# Altium schematic sheet oxi_dev2(modified).SchDoc
size A1
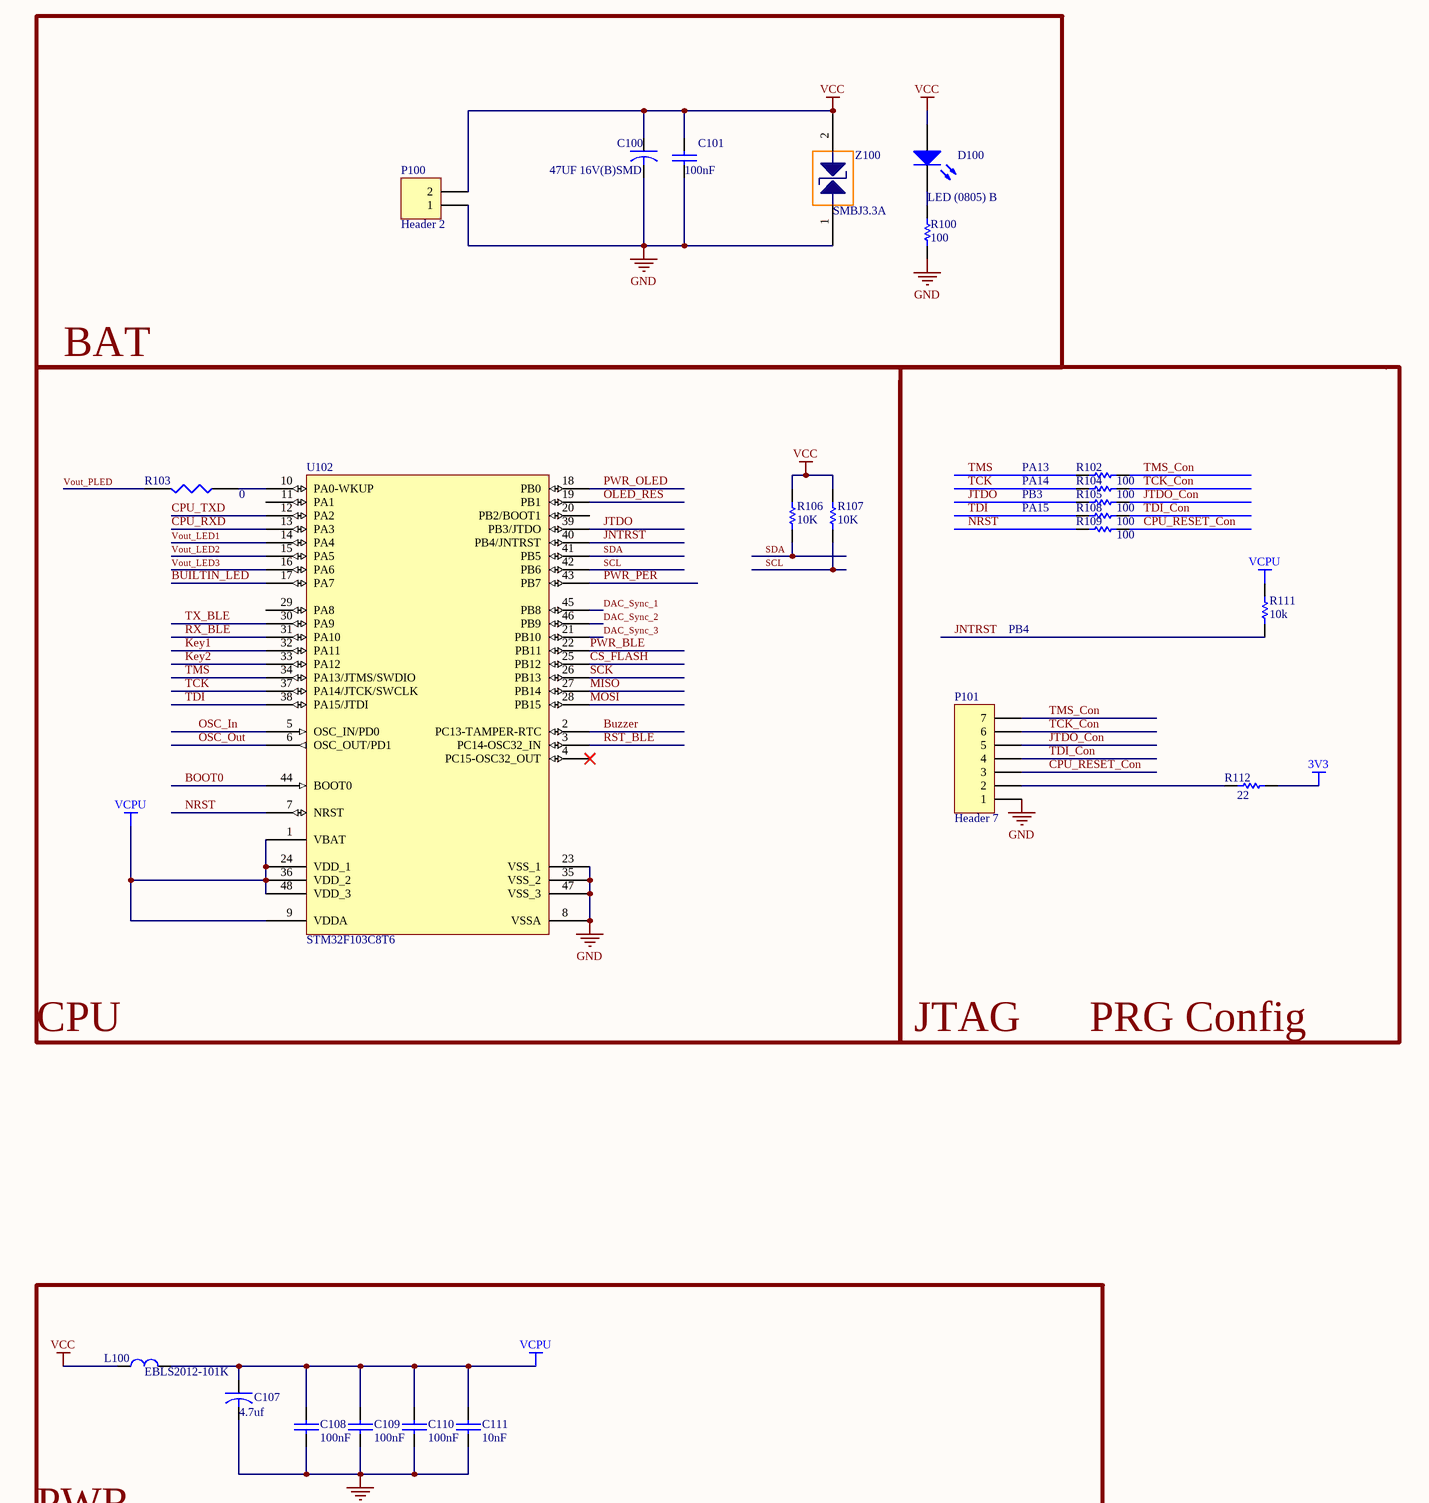
[diagram p0: oxi_dev2(modified).SchDoc, top left]
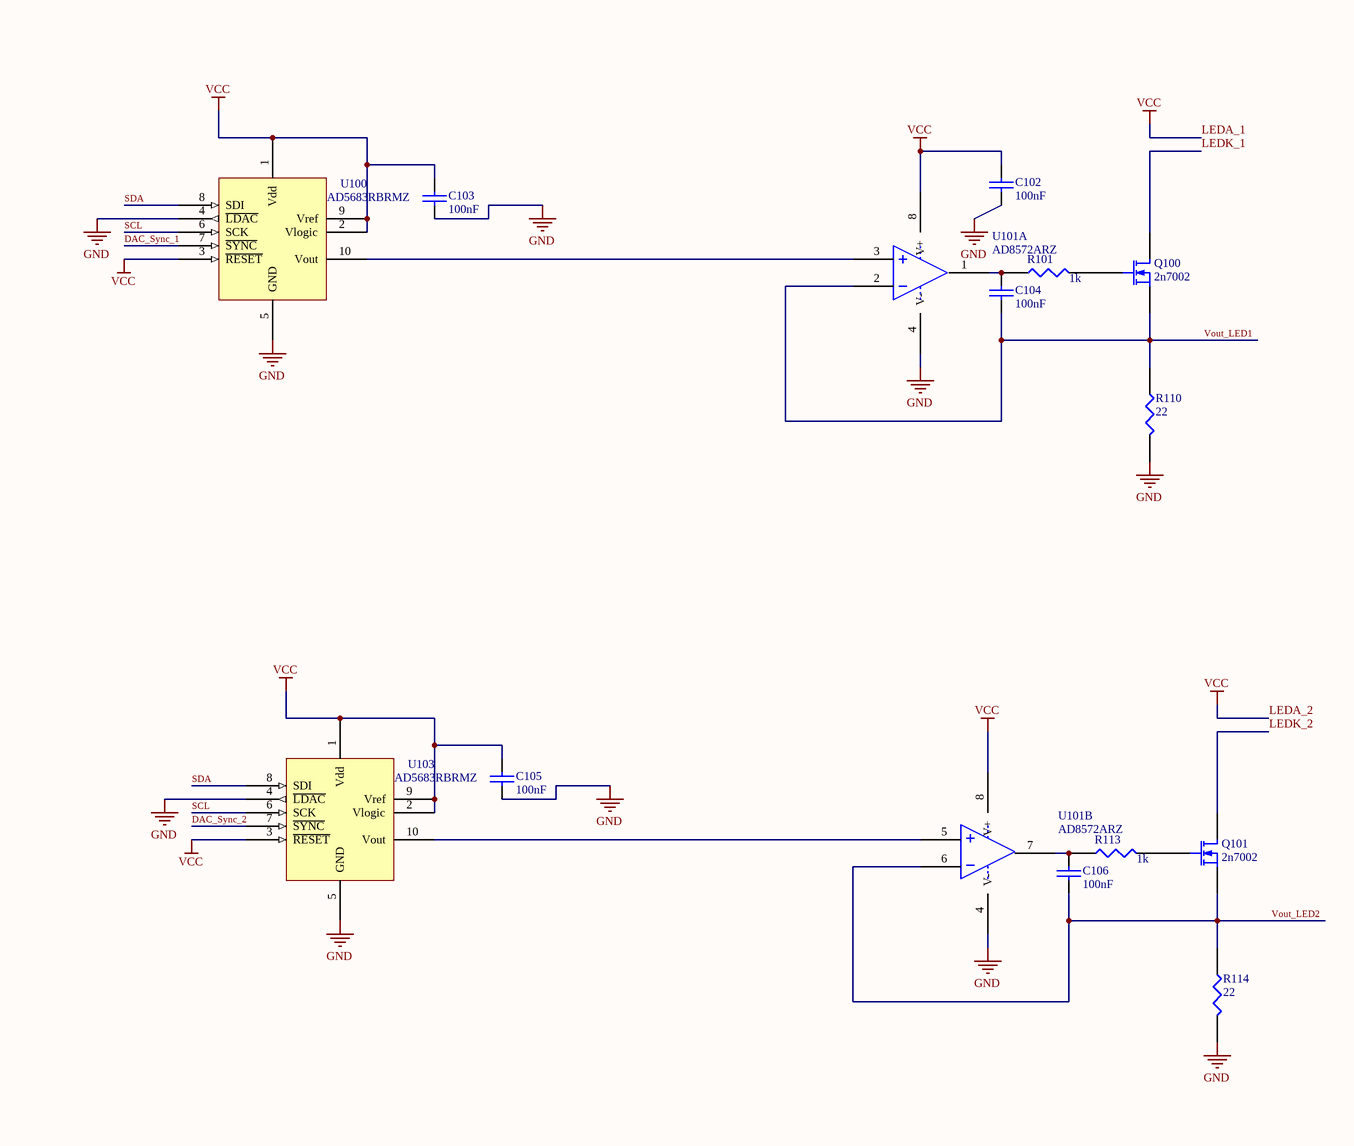
[diagram p1: oxi_dev2(modified).SchDoc, top middle]
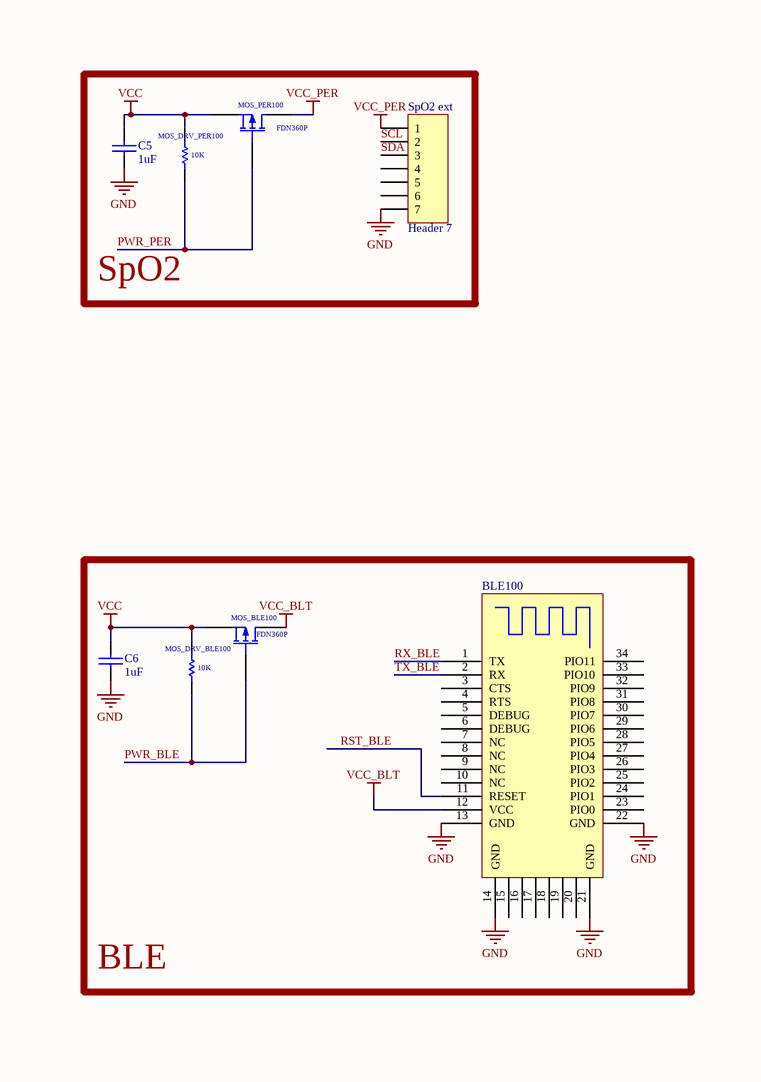
[diagram p2: oxi_dev2(modified).SchDoc, top right]
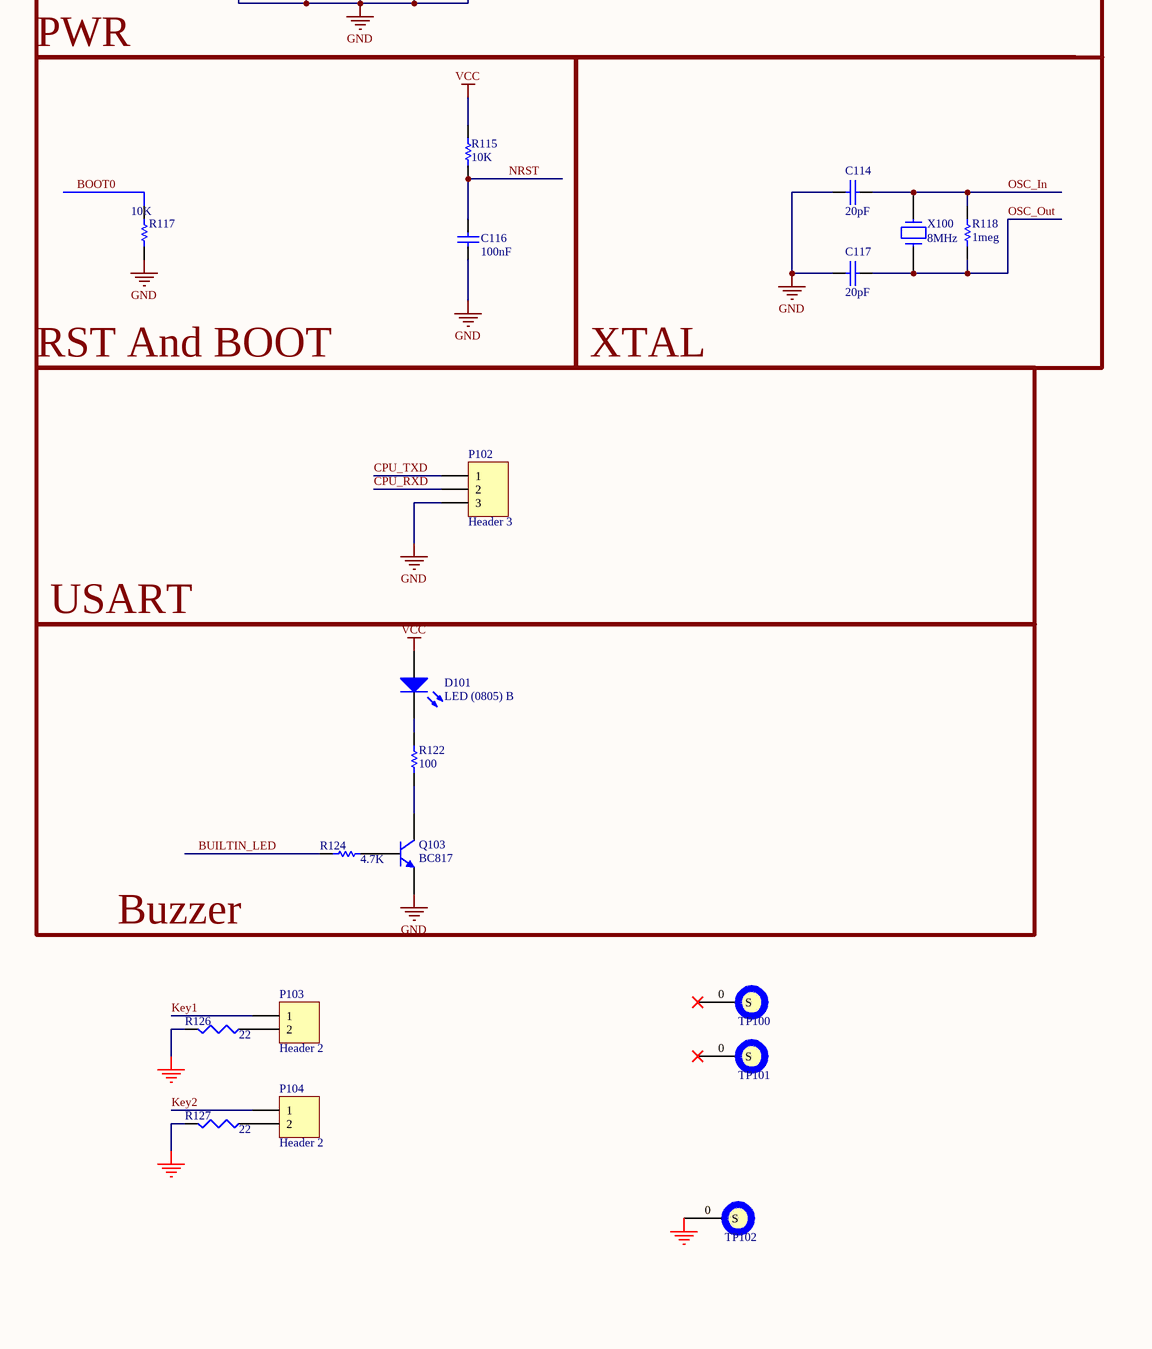
[diagram p3: oxi_dev2(modified).SchDoc, bottom left]
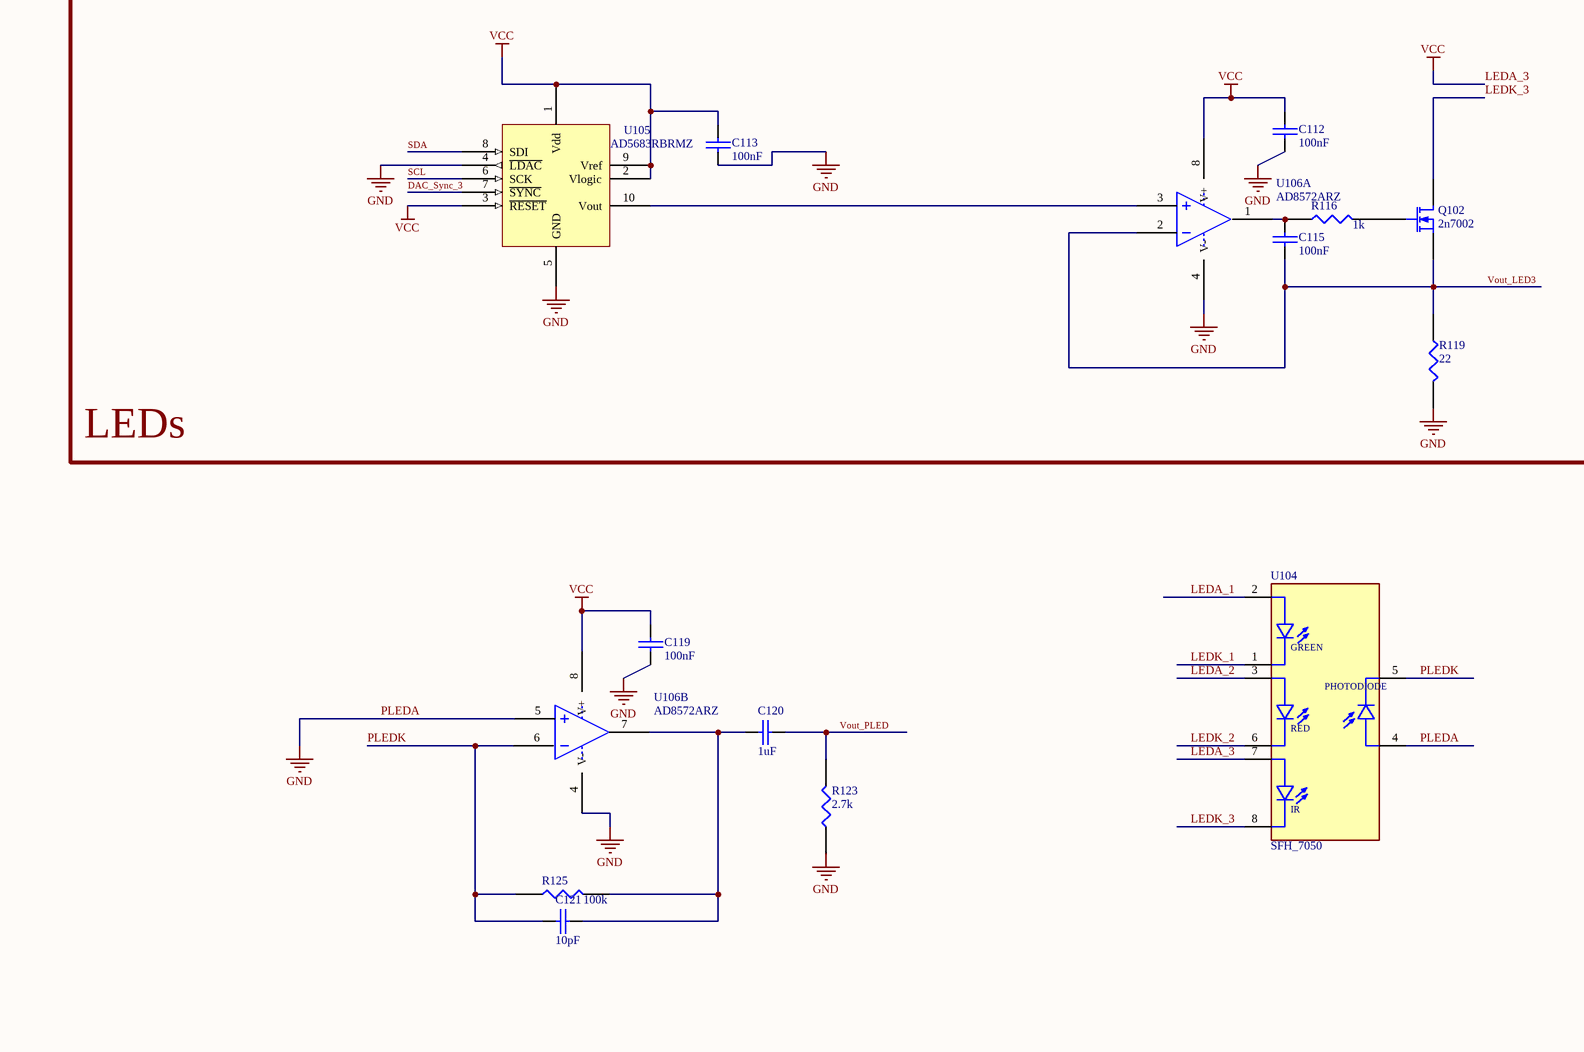
[diagram p4: oxi_dev2(modified).SchDoc, bottom middle]
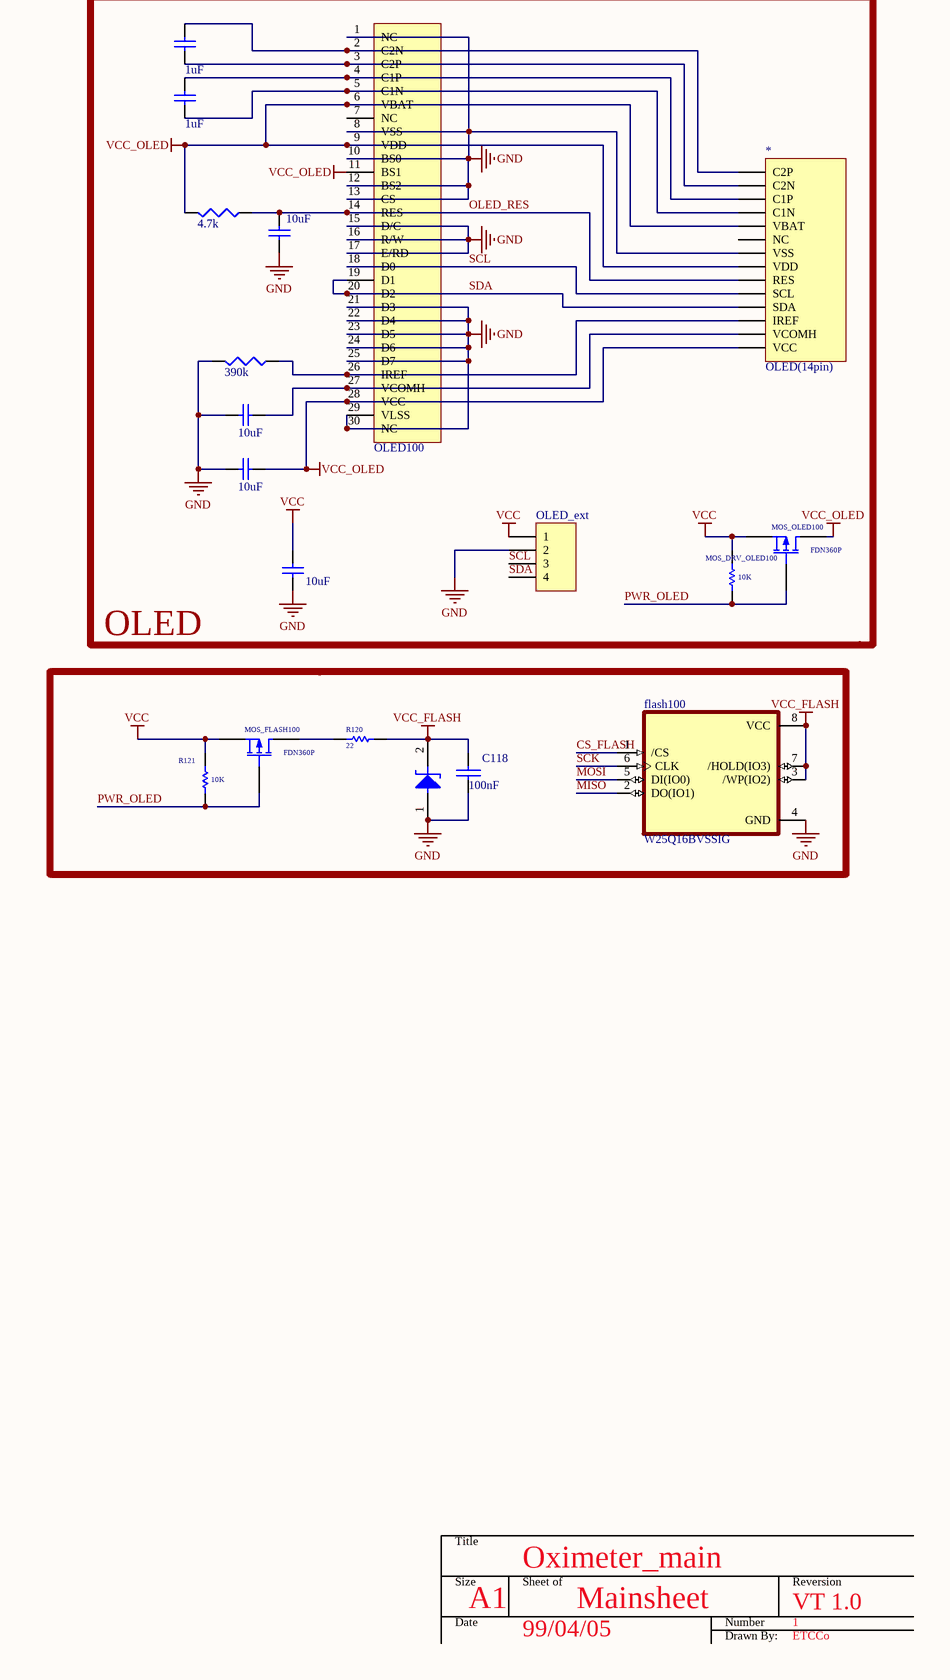
[diagram p5: oxi_dev2(modified).SchDoc, bottom right]

## Parts
*  OLED(14pin)  [oled0.91_no3d]
BLE100  HM-16  [HM-16]  (value not drawn)
BRIGHTNESS_RES100  value 390k  [SMD-0805C]  (hidden comment: Res3)
C5  1uF  [0603-2]
C6  1uF  [0603-2]
C100  47UF 16V(B)SMD  [a_SMB]
C101  100nF  [0805-CAP]
C102  100nF  [0805-2]
C103  100nF  [0805-2]
C104  100nF  [0805-2]
C105  100nF  [0805-2]
C106  100nF  [0805-2]
C107  4.7uf  [CAP-A]
C108  100nF  [0603-2]
C109  100nF  [0603-2]
C110  100nF  [0603-2]
C111  10nF  [0603-2]
C112  100nF  [0805-2]
C113  100nF  [0805-2]
C114  20pF  [0805-2]
C115  100nF  [0805-2]
C116  100nF  [0805-2]
C117  20pF  [0805-2]
C118  100nF  [0805-CAP]
C119  100nF  [0805-2]
C120  1uF  [0805-2]
C121  10pF  [0805-2]
C_PUMP_100  value 1uF  [SMD-0805C]  (hidden comment: Cap Semi)
C_PUMP_101  value 1uF  [SMD-0805C]  (hidden comment: Cap Semi)
C_PUMP_VCMON100  value 10uF  [SMD-0805C]  (hidden comment: Cap Semi)
D100  LED (0805) B  [0805D]
D101  LED (0805) B  [0805D]
flash100  W25Q16BVSSIG  [SOIC127P790X216-8N]
L100  EBLS2012-101K  [0805-2]
MOS_BLE100  FDN360P  [SOT23_N]
MOS_DRV_BLE100  10K  [SMD-0805C]
MOS_DRV_OLED100  10K  [SMD-0805C]
MOS_DRV_PER100  10K  [SMD-0805C]
MOS_FLASH100  FDN360P  [SOT23_N]
MOS_OLED100  FDN360P  [SOT23_N]
MOS_PER100  FDN360P  [SOT23_N]
OLED100  OLED  [OLED0.96_NO3D]  (value not drawn)
OLED_C_STABILITY100  value 10uF  [SMD-0805C]  (hidden comment: Cap Semi)
OLED_C_STABILITY?  value 10uF  [SMD-0805C]  (hidden comment: Cap Semi)
OLED_ext  Header 4  [HDR1X4]  (value not drawn)
OLED_RES_PU100  value 4.7k  [SMD-0805C]  (hidden comment: Res3)
P100  Header 2  [A_HDR1X2]
P101  Header 7  [HDR1X7_Editted]
P102  Header 3  [A_HDR1X3_editted]
P103  Header 2  [TACT-1]
P104  Header 2  [TACT-1]
Q100  2n7002  [a_SOT23]
Q101  2n7002  [a_SOT23]
Q102  2n7002  [a_SOT23]
Q103  BC817  [SOT23]
R100  100  [0805-2]
R101  1k  [0603-2]
R102  100  [0805-2]
R103  0  [0603-2]
R104  100  [0805-2]
R105  100  [0805-2]
R106  10K  [0805-2]
R107  10K  [0805-2]
R108  100  [0805-2]
R109  100  [0805-2]
R110  22  [0603-2]
R111  10k  [0603-2]
R112  22  [0805-2]
R113  1k  [0603-2]
R114  22  [0603-2]
R115  10K  [0805-2]
R116  1k  [0603-2]
R117  10K  [0603-2]
R118  1meg  [0805-2]
R119  22  [0603-2]
R120  22  [SMD-0805C]
R121  10K  [SMD-0805C]
R122  100  [0805-2]
R123  2.7k  [0603-2]
R124  4.7K  [0603-2]
R125  100k  [0603-2]
R126  22  [0805-2]
R127  22  [0805-2]
RES_BYPASS100  value 10uF  [SMD-0805C]  (hidden comment: Cap Semi)
SpO2_ext  Header 7  [HDR1X7_Editted]
TP100  HOLE  [A_Ert]  (value not drawn)
TP101  HOLE  [A_Ert]  (value not drawn)
TP102  HOLE  [TP_Net]  (value not drawn)
U100  AD5683RBRMZ  [SO-10]
U101  AD8572ARZ  [SO-8]  (parts A,B of 2)
U102  STM32F103C8T6  [LQFP48_N]
U103  AD5683RBRMZ  [SO-10]
U104  SFH_7050  [XDCR_SFH_7050]
U105  AD5683RBRMZ  [SO-10]
U106  AD8572ARZ  [SO-8]  (parts A,B of 2)
X100  8MHz  [A_XTAL]
Z100  SMBJ3.3A  [a_SMB]
ZEN_USB100  5V  [DSMD]  (value not drawn)

## Blocks framed on the sheet
BAT: C100 C101 D100 P100 R100 Z100
LEDs: C102-C106 C112 C113 C115 Q100-Q102 R101 R110 R113 R114 R116 R119 U100 U101 U103 U105 U106
BLE: BLE100 C6 MOS_BLE100 MOS_DRV_BLE100
PWR: C107-C111 L100
OLED: * BRIGHTNESS_RES100 C_PUMP_100 C_PUMP_101 C_PUMP_VCMON100 MOS_DRV_OLED100 MOS_OLED100 OLED100 OLED_C_STABILITY100 OLED_C_STABILITY? OLED_ext OLED_RES_PU100 RES_BYPASS100

## Nets
3V3: R112.2
LEDA_1: C5.1 C6.1 C100.2 C101.1 C102.1 C103.1 C105.1 C112.1 C113.1 C119.1 D100.1(A) D101.1(A) L100.1 MOS_BLE100.2(S) MOS_DRV_BLE100.1 MOS_DRV_OLED100.1 MOS_DRV_PER100.1 MOS_FLASH100.2(S) MOS_OLED100.2(S) MOS_PER100.2(S) OLED_C_STABILITY?.1 OLED_ext.1 P100.2 R106.1 R107.1 R115.2 R121.1 U100.1(Vdd) U100.2(Vlogic) U100.3(~{RESET}) U100.9(Vref) U101.8(V+) U103.1(Vdd) U103.2(Vlogic) U103.3(~{RESET}) U103.9(Vref) U104.2(GA) U104.3(RA) U104.7(IA) U105.1(Vdd) U105.2(Vlogic) U105.3(~{RESET}) U105.9(Vref) U106.8(V+) Z100.2  [also labelled LEDA_2, LEDA_3, VCC]
PLEDA: *.7(VSS) BLE100.13(GND) BLE100.14(GND) BLE100.21(GND) BLE100.22(GND) BRIGHTNESS_RES100.2 C5.2 C6.2 C100.1 C101.2 C102.2 C103.2 C105.2 C107.2 C108.2 C109.2 C110.2 C111.2 C112.2 C113.2 C114.2 C116.1 C117.2 C118.2 C119.2 C_PUMP_VCMON100.2 flash100.4(GND) OLED100.1(NC) OLED100.8(VSS) OLED100.10(BS0) OLED100.12(BS2) OLED100.13(CS) OLED100.15(D/C) OLED100.16(R/W) OLED100.17(E/RD) OLED100.21(D3) OLED100.22(D4) OLED100.23(D5) OLED100.24(D6) OLED100.25(D7) OLED100.29(VLSS) OLED100.30(NC) OLED_C_STABILITY100.2 OLED_C_STABILITY?.2 OLED_ext.2 P100.1 P101.1 P102.3 Q103.2(E) R100.1 R110.2 R114.2 R117.2 R119.2 R123.1 R126.2 R127.2 RES_BYPASS100.1 SpO2_ext.7 TP102.0(S) U100.4(~{LDAC}) U100.5(GND) U101.4(V-) U102.8(VSSA) U102.23(VSS_1) U102.35(VSS_2) U102.47(VSS_3) U103.4(~{LDAC}) U103.5(GND) U104.4(PA) U105.4(~{LDAC}) U105.5(GND) U106.4(V-) U106.5(IN+) Z100.1 ZEN_USB100.1  [also labelled GND]
VCC_BLT: BLE100.12(VCC) MOS_BLE100.3(D)
VCC_FLASH: C118.1 flash100.3(/WP(IO2)) flash100.7(/HOLD(IO3)) flash100.8(VCC) R120.2 ZEN_USB100.2
VCC_OLED: *.5(VBAT) *.8(VDD) *.14(VCC) MOS_OLED100.3(D) OLED100.6(VBAT) OLED100.9(VDD) OLED100.11(BS1) OLED100.28(VCC) OLED_C_STABILITY100.1 OLED_RES_PU100.2
VCC_PER: MOS_PER100.3(D) SpO2_ext.1
VCPU: C107.1 C108.1 C109.1 C110.1 C111.1 L100.2 R111.1 U102.1(VBAT) U102.9(VDDA) U102.24(VDD_1) U102.36(VDD_2) U102.48(VDD_3)
BOOT0: R117.1 U102.44(BOOT0)
BUILTIN_LED: R124.2 U102.17(PA7)
Buzzer: U102.2(PC13-TAMPER-RTC)
CPU_~{RESE}T_Co~{n}: P101.3 R109.1
CPU_RXD: P102.2 U102.13(PA3)
CPU_TXD: P102.1 U102.12(PA2)
CS_FLASH: flash100.1(/CS) U102.25(PB12)
DAC_Sync_1: U100.7(~{SYNC}) U102.45(PB8)
DAC_Sync_2: U102.46(PB9) U103.7(~{SYNC})
DAC_Sync_3: U102.21(PB10) U105.7(~{SYNC})
JNTRST: R111.2 U102.40(PB4/JNTRST)
JTDO: R105.2 U102.39(PB3/JTDO)
JTDO_Con: P101.5 R105.1
Key1: P103.1 U102.32(PA11)
Key2: P104.1 U102.33(PA12)
LEDK_1: Q100.3(D) U104.1(GC)
LEDK_2: Q101.3(D) U104.6(RC)
LEDK_3: Q102.3(D) U104.8(IC)
MISO: flash100.2(DO(IO1)) U102.27(PB14)
MOSI: flash100.5(DI(IO0)) U102.28(PB15)
NRST: C116.2 R109.2 R115.1 U102.7(NRST)
OLED_RES: *.9(RES) OLED100.14(RES) OLED_RES_PU100.1 RES_BYPASS100.2 U102.19(PB1)
OSC_In: C114.1 R118.1 U102.5(OSC_IN/PD0) X100.2
OSC_Out: C117.1 R118.2 U102.6(OSC_OUT/PD1) X100.1
PLEDK: C121.1 R125.1 U104.5(PC) U106.6(IN-)
PWR_BLE: MOS_BLE100.1(G) MOS_DRV_BLE100.2 U102.22(PB11)
PWR_OLED: MOS_DRV_OLED100.2 MOS_FLASH100.1(G) MOS_OLED100.1(G) R121.2 U102.18(PB0)
PWR_PER: MOS_DRV_PER100.2 MOS_PER100.1(G) U102.43(PB7)
RST_BLE: BLE100.11(RESET) U102.3(PC14-OSC32_IN)
RX_BLE: BLE100.1(TX) U102.31(PA10)
SCK: flash100.6(CLK) U102.26(PB13)
SCL: *.10(SCL) OLED100.18(D0) OLED_ext.3 R107.2 SpO2_ext.2 U100.6(SCK) U102.42(PB6) U103.6(SCK) U105.6(SCK)
SDA: *.11(SDA) OLED100.19(D1) OLED100.20(D2) OLED_ext.4 R106.2 SpO2_ext.3 U100.8(SDI) U102.41(PB5) U103.8(SDI) U105.8(SDI)
TCK: R104.2 U102.37(PA14/JTCK/SWCLK)
TCK_Con: P101.6 R104.1
TDI: R108.2 U102.38(PA15/JTDI)
TDI_Con: P101.4 R108.1
TMS: R102.2 U102.34(PA13/JTMS/SWDIO)
TMS_Con: P101.7 R102.1
TX_BLE: BLE100.2(RX) U102.30(PA9)
Vout_LED1: C104.2 Q100.2(S) R110.1 U101.2(IN-) U102.14(PA4)
Vout_LED2: C106.2 Q101.2(S) R114.1 U101.6(IN-) U102.15(PA5)
Vout_LED3: C115.2 Q102.2(S) R119.1 U102.16(PA6) U106.2(IN-)
Vout_PLED: C120.2 R103.2 R123.2
Net*_1: *.1(C2P) C_PUMP_100.2 OLED100.2(C2N)
Net*_2: *.2(C2N) C_PUMP_100.1 OLED100.3(C2P)
Net*_3: *.3(C1P) C_PUMP_101.2 OLED100.4(C1P)
Net*_4: *.4(C1N) C_PUMP_101.1 OLED100.5(C1N)
Net*_12: *.12(IREF) BRIGHTNESS_RES100.1 OLED100.26(IREF)
Net*_13: *.13(VCOMH) C_PUMP_VCMON100.1 OLED100.27(VCOMH)
NetC104_1: C104.1 R101.1 U101.1(OUT)
NetC106_1: C106.1 R113.1 U101.7(OUT)
NetC115_1: C115.1 R116.1 U106.1(OUT)
NetC120_1: C120.1 C121.2 R125.2 U106.7(OUT)
NetD100_2: D100.2(K) R100.2
NetD101_2: D101.2(K) R122.1
NetMOS_FLASH100_3: MOS_FLASH100.3(D) R120.1
NetP101_2: P101.2 R112.1
NetP103_2: P103.2 R126.1
NetP104_2: P104.2 R127.1
NetQ100_1: Q100.1(G) R101.2
NetQ101_1: Q101.1(G) R113.2
NetQ102_1: Q102.1(G) R116.2
NetQ103_1: Q103.1(B) R124.1
NetQ103_3: Q103.3(C) R122.2
NetR103_1: R103.1 U102.10(PA0-WKUP)
NetU100_10: U100.10(Vout) U101.3(IN+)
NetU101_5: U101.5(IN+) U103.10(Vout)
NetU105_10: U105.10(Vout) U106.3(IN+)

Not connected (* = marked no-connect by the designer): * 6(NC); BLE100 3(CTS) 4(RTS) 5(DEBUG) 6(DEBUG) 7(NC) 8(NC) 9(NC) 10(NC) 15 16 17 18 19 20 23(PIO0) 24(PIO1) 25(PIO2) 26(PIO3) 27(PIO4) 28(PIO5) 29(PIO6) 30(PIO7) 31(PIO8) 32(PIO9) 33(PIO10) 34(PIO11); OLED100 7(NC); SpO2_ext 4 5 6; TP100 0(S)*; TP101 0(S)*; U102 4(PC15-OSC32_OUT)* 11(PA1) 20(PB2/BOOT1) 29(PA8)

## Notes on the sheet
- SpO2
- PA13
- PB3
- PA15
- PA14
- PB4
- CPU
- JTAG
- PRG Config
- RST And BOOT
- XTAL
- USART
- Buzzer
- Title
- Oximeter_main
- Size
- Date
- A1
- Sheet of
- 99/04/05
- Mainsheet
- Number
- Drawn By:
- Reversion
- ETCCo
- VT 1.0
- 1
- (in symbol SFH_7050) GREEN; PHOTODIODE; RED; IR

## Library data of the parts
BRIGHTNESS_RES100 OLED_RES_PU100 = Res3: Resistor; Published: 8-Jun-2000; LatestRevisionDate: 29-May-2009; LatestRevisionNote: IPC-7351 Footprint Added.; PackageReference: J1-0603; Publisher: Altium Limited; PackageDescription: Chip Resistor
C5 C6 C101-C106 C108-C115 C117-C121 = CAP: Capacitor
C100 = CAPACITOR: TAJD106M035RNJ
C107 = CAPACITOR: TAJA106M010RNJ: 10UF/10V
C116 = CAP: Capacitor; Value: 100pF; Published: 8-Jun-2000; Revision: July-2002: Re-released for DXP Platform.; Publisher: Altium Limited
C_PUMP_100 C_PUMP_101 C_PUMP_VCMON100 OLED_C_STABILITY100 OLED_C_STABILITY? RES_BYPASS100 = Cap Semi: Capacitor (Semiconductor SIM Model); Published: 8-Jun-2000; LatestRevisionDate: 29-May-2009; LatestRevisionNote: IPC-7351 Footprint Added.; PackageReference: C1206; Publisher: Altium Limited; PackageDescription: Chip Capacitor
D100 D101 = LED3: Typical BLUE SiC LED; Published: 8-Jun-2000; LatestRevisionDate: 17-Dec-2003; LatestRevisionNote: PCB Footprint replaced.; DatasheetDocument: 16-Apr-2002; PackageDocument: 16-Apr-2002; PackageReference: 3.5X2.8X1.9; Publisher: Altium Limited
flash100 = W25Q16BVSSIG: FLASH - NOR Memory IC 16Mb _2M x 8_ SPI 104MHz 8-SOIC; MF: Winbond; Availability: Unavailable; MP: W25Q16BVSSIG; SnapEDA_Link: https://www.snapeda.com/parts/W25Q16BVSSIG/Winbond%20Electronics/view-part/512685/?ref=snap; Value: *; Price: None; Package: SOIC-8 Winbond
L100 = INDUCTOR: Inductor 100UH (0805); GLFR1608T100M-LR: 10UH
MOS_BLE100 MOS_FLASH100 MOS_OLED100 MOS_PER100 = MOSFET-P: P-Channel MOSFET; Published: 8-Jun-2000; LatestRevisionDate: 17-Jul-2002; LatestRevisionNote: Re-released for DXP Platform.; PackageVersion: 1995/1996; PackageReference: E3; Publisher: Altium Limited; PackageDescription: TO, Flat Index; 3 In-Line, Axial Leads; Body Dia. 4.6mm; Lead Dia. 0.5 mm (max)
MOS_DRV_BLE100 MOS_DRV_OLED100 MOS_DRV_PER100 R115 R120 R121 = res1: Resistor; Value: 1K; Published: 8-Jun-2000; Revision: July-2002: Re-released for DXP Platform.; Publisher: Altium Limited
OLED100 = OLED0.96
OLED_ext = Header 4: Header, 4-Pin; LatestRevisionDate: 17-Jul-2002; LatestRevisionNote: Re-released for DXP Platform.; Publisher: Altium Limited
P100 P103 P104 = Header 2: Header, 2-Pin; LatestRevisionDate: 17-Jul-2002; LatestRevisionNote: Re-released for DXP Platform.; Publisher: Altium Limited
P101 SpO2_ext = Header 7: Header, 7-Pin; LatestRevisionDate: 17-Jul-2002; LatestRevisionNote: Re-released for DXP Platform.; Publisher: Altium Limited
P102 = Header 3: Header, 3-Pin; LatestRevisionDate: 17-Jul-2002; LatestRevisionNote: Re-released for DXP Platform.; Publisher: Altium Limited
Q100-Q102 = MOSFET-N: N-Channel MOSFET; Published: 8-Jun-2000; LatestRevisionDate: 17-Jul-2002; LatestRevisionNote: Re-released for DXP Platform.; PackageVersion: 1995/1996; PackageReference: E3; Publisher: Altium Limited; PackageDescription: TO, Flat Index; 3 In-Line, Axial Leads; Body Dia. 4.6mm; Lead Dia. 0.5 mm (max)
Q103 = 2N3904: NPN General Purpose Amplifier; Published: 8-Jun-2000; LatestRevisionDate: 15-Jan-2003; LatestRevisionNote: PCB Footprint 'BCY-W3/D4.7' replaced; DatasheetVersion: 1997; PackageVersion: Sep-1998; PackageReference: TO-92A; Publisher: Altium Limited; PackageDescription: TO, Flat Index; 3 In-Line, Axial Leads; Body Dia. 4.5mm; Leads 0.51 x 0.48 mm (max); ComponentLink1Description: Manufacturer Link; ComponentLink1URL: http://www.fairchildsemi.com/; ComponentLink2Description: Datasheet; ComponentLink2URL: http://www.fairchildsemi.com/ds/2N%2F2N3904.pdf
R100 R102 R104-R109 R111 R112 R117 R118 R122 R124 = Res1: Resistor; Value: 1K; Published: 8-Jun-2000; Revision: July-2002: Re-released for DXP Platform.; Publisher: Altium Limited
R101 R103 R110 R113 R114 R116 R119 R123 R125-R127 = RES1
TP100-TP102 = TP
U100 U103 U105 = AD5683RBRMZ: Tiny 16-/14-/12-Bit SPI nanoDAC+, with  ±2 (16-Bit) LSB INL and 2 ppm/°C Reference
U101 U106 = NJM3404
U102 = STM32F103C8T6: STM32 ARM-based 32-bit MCU with 64 Kbytes Flash, 48-pin LQFP, Industrial Temperature; Published: *; DatasheetVersion: *; PackageVersion: *; PackageReference: *; Publisher: *; PackageDescription: *; ComponentLink1Description: *; ComponentLink1URL: *; ComponentLink2Description: *; ComponentLink2URL: *
U104 = SFH_7050: Salida de voltaje del sensor de ox?­metro / frecuencia card?­aca; MF: OSRAM Opto; Digi-Key_Part_Number: 475-3346-1-ND; Digi-Key_Purchase_URL: https://www.digikey.com/product-detail/en/osram-opto-semiconductors-inc/SFH-7050/475-3346-1-ND/7645273?utm_source=snapeda&utm_medium=aggregator&utm_campaign=symbol; Package: None; MP: SFH 7050; Value: *; SnapEDA_Link: https://www.snapeda.com/parts/SFH%207050/OSRAM%20Opto%20Semiconductors%20Inc./view-part/227176/?ref=snap
X100 = CRYSTAL: NTK-8.000000-HC49US
Z100 = A_TVS: 400W SURFACE MOUNT TVS
ZEN_USB100 = ZENER